# Altium schematic sheet Voeding.SchDoc
size A4; SheetNumber: 1; SheetTotal: 4
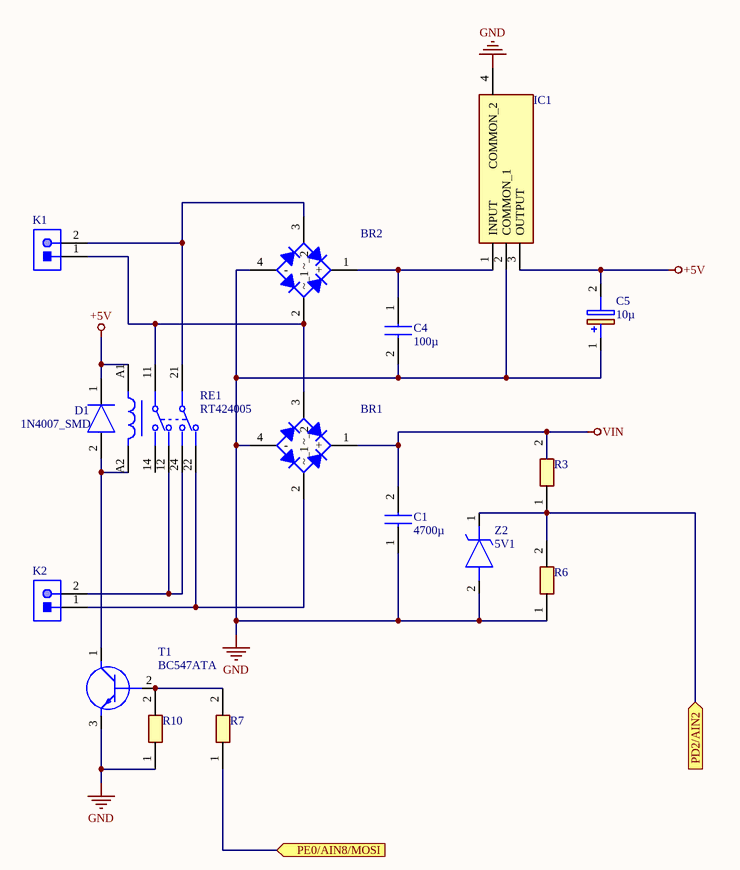
[diagram p0: Voeding.SchDoc]

## Parts
BR1  GBU6J-E3_45  [GBU6JE345]  (value not drawn)
BR2  GBU6J-E3_45  [GBU6JE345]  (value not drawn)
C1  4700µ  [CAPPRD1000W80D2200H4100]
C4  100µ  [CAPPRD350W52D800H1300]
C5  10µ  [CAPPRD200W52D500H1250]
D1  1N4007_SMD  [DIOM5027X262N]
IC1  TL780-05CKTTR  [TL78005CKTTR]  (value not drawn)
K1  620102131822  [620102131822]  (value not drawn)
K2  620102131822  [620102131822]  (value not drawn)
R3  (no value)  [RESC2012X90N]
R6  (no value)  [RESC2012X90N]
R7  (no value)  [RESC2012X90N]
R10  (no value)  [RESC2012X90N]
RE1  RT424005  [RT42]
T1  BC547ATA  [TO-92_(TO-226)]
Z2  5V1  [SODFL1608X65N]

## Ports
PD2/AIN2 (in), PE0/AIN8/MOSI (in)

## Nets
+5V: C5.2(-) D1.1(K) IC1.3(OUTPUT) RE1.A1
GND: BR1.4(-) BR2.4(-) C1.1(+) C4.2(-) C5.1(+) IC1.2(COMMON_1) IC1.4(COMMON_2) R6.1 R10.1 T1.3(E) Z2.2(A)
VIN: BR1.1(+) C1.2(-) R3.2
PD2/AIN2: R3.1 R6.2 Z2.1(K) ; port PD2/AIN2
PE0/AIN8/MOSI: R7.1 ; port PE0/AIN8/MOSI
NetBR1_2: BR1.2(~_1) K2.1 RE1.22
NetBR1_3: BR1.3(~_2) BR2.2(~_1) K1.1 RE1.11
NetBR2_1: BR2.1(+) C4.1(+) IC1.1(INPUT)
NetBR2_3: BR2.3(~_2) K1.2 RE1.21
NetD1_2: D1.2(A) RE1.A2 T1.1(C)
NetK2_2: K2.2 RE1.12 RE1.24
NetR7_2: R7.2 R10.2 T1.2(B)

Not connected (* = marked no-connect by the designer): RE1 14

## Library data of the parts
BR1 BR2 = GBU6J-E3_45: Bridge Rectifier; Manufacturer_Name: Vishay; Manufacturer_Part_Number: GBU6J-E3/45; Datasheet Link: http://www.vishay.com/docs/88615/gbu6a.pdf; Height: 18.8mm
C1 = 860010683032: Capacitor; Manufacturer_Name: Wurth Elektronik; Datasheet Link: https://componentsearchengine.com/Datasheets/2/860010683032.pdf; Height: 41mm; Manufacturer_Part_Number: 860010683032; Mouser Part Number: 710-860010683032; Mouser Price/Stock: https://www.mouser.co.uk/ProductDetail/Wurth-Elektronik/860010683032?qs=0KOYDY2FL2%252Biyra9tgGF6Q%3D%3D
C4 = 860010674014: Capacitor; Manufacturer_Name: Wurth Elektronik; Datasheet Link: http://uk.rs-online.com/web/p/products/8397074; Height: 13mm; Manufacturer_Part_Number: 860010674014; Mouser Part Number: 710-860010674014; Mouser Price/Stock: https://www.mouser.co.uk/ProductDetail/Wurth-Elektronik/860010674014?qs=0KOYDY2FL2%2Fk%2F1RkUOIquw%3D%3D
C5 = 860010672009: Capacitor Polarised; Manufacturer_Name: Wurth Elektronik; Datasheet Link: https://componentsearchengine.com/Datasheets/2/860010672009.pdf; Height: 12.5mm; Manufacturer_Part_Number: 860010672009; Mouser Part Number: 710-860010672009; Mouser Price/Stock: https://www.mouser.com/Search/Refine.aspx?Keyword=710-860010672009
D1 = 1N4007_SMD: Diode; Manufacturer_Name: MULTICOMP; Manufacturer_Part_Number: 1N4007 SMD; Datasheet Link: https://componentsearchengine.com/Datasheets/2/1N4007 SMD.pdf; Height: 2.62mm
IC1 = TL780-05CKTTR: Integrated Circuit; Manufacturer_Name: Texas Instruments; Datasheet Link: http://www.ti.com/general/docs/suppproductinfo.tsp?distId=26&gotoUrl=http%3A%2F%2Fwww.ti.com%2Flit%2Fgpn%2Ftl780; Height: 5.08mm; Manufacturer_Part_Number: TL780-05CKTTR; Mouser Part Number: 595-TL780-05CKTTR; Mouser Price/Stock: https://www.mouser.co.uk/ProductDetail/Texas-Instruments/TL780-05CKTTR?qs=7kv20MEVUlhtPP21hgiOlA%3D%3D; Arrow Part Number: TL780-05CKTTR; Arrow Price/Stock: https://www.arrow.com/en/products/tl780-05ckttr/texas-instruments?region=nac
K1 K2 = CMP-1502-00669-1: Male Shrouded Header WR-WTB, SMT, Right Angled, pitch 2 mm, 1 x 2 position; Manufacturer: Wurth Elektronik; Position: 1x2; Working Voltage: 100VAC; Contact Resistance: 20mOhm; Pitch: 2mm; Packaging: TapeandReel; Part Number: 620102131822; Publisher: WurthElektronik; Mounting Technology: SMT; Manufacturer URL: http://www.we-online.de; Datasheet URL: https://katalog.we-online.de/em/datasheet/6201xx131822.pdf; Gender: Male; Operating Temperature: -25to85degC; Package Reference: 620102131822; Orientation: RightAngled
R3 R6 R7 R10 = CFN0805-JZ-R010ELF: Resistor; Manufacturer_Name: Bourns; Datasheet Link: https://www.bourns.com/docs/Product-Datasheets/CFN.pdf; Height: 0.9mm; Manufacturer_Part_Number: CFN0805-JZ-R010ELF
RE1 = RT424005: Relay or Contactor; Manufacturer_Name: TE Connectivity; Datasheet Link: https://www.te.com/commerce/DocumentDelivery/DDEController?Action=showdoc&DocId=Data+Sheet%7FRT2%7F1014%7Fpdf%7FEnglish%7FENG_DS_RT2_1014.pdf%7F5-1393243-9; Manufacturer_Part_Number: RT424005; Mouser Part Number: 655-RT424005; Mouser Price/Stock: https://www.mouser.co.uk/ProductDetail/TE-Connectivity-Schrack/RT424005?qs=KKrrU%252BaSadKRsQcVuAjnsQ%3D%3D; Arrow Part Number: RT424005; Arrow Price/Stock: https://www.arrow.com/en/products/rt424005/te-connectivity?region=nac
T1 = BC547ATA: Transistor BJT NPN; Manufacturer_Name: ON Semiconductor; Datasheet Link: https://www.onsemi.com/pub/Collateral/BC550-D.pdf; Manufacturer_Part_Number: BC547ATA; Mouser Part Number: 512-BC547ATA; Mouser Price/Stock: https://www.mouser.co.uk/ProductDetail/ON-Semiconductor-Fairchild/BC547ATA?qs=ljbEvF4DwOMRdLfuzO8N4w%3D%3D; Arrow Part Number: BC547ATA; Arrow Price/Stock: https://www.arrow.com/en/products/bc547ata/on-semiconductor?region=europe
Z2 = BZT52C12TQ-7-F: Zener Diode; Manufacturer_Name: Diodes Inc.; Datasheet Link: https://www.diodes.com/assets/Datasheets/ds30502.pdf; Height: 0.65mm; Manufacturer_Part_Number: BZT52C12TQ-7-F; Mouser Part Number: 621-BZT52C12TQ-7-F; Mouser Price/Stock: https://www.mouser.co.uk/ProductDetail/Diodes-Incorporated/BZT52C12TQ-7-F?qs=W0yvOO0ixfHNmW9JdWu87w%3D%3D; Arrow Part Number: BZT52C12TQ-7-F; Arrow Price/Stock: https://www.arrow.com/en/products/bzt52c12tq-7-f/diodes-incorporated?region=nac